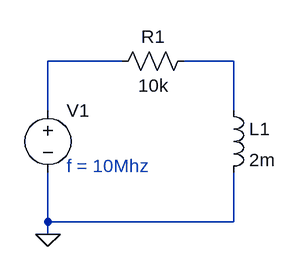
[diagram p0: schematic Draft2.asc]
Draft2.asc, the LTspice schematic file:
Version 4
SHEET 1 880 680
WIRE 192 64 96 64
WIRE 336 64 272 64
WIRE 96 128 96 64
WIRE 336 128 336 64
WIRE 96 272 96 208
WIRE 336 272 336 208
WIRE 336 272 96 272
WIRE 96 288 96 272
FLAG 96 288 0
SYMBOL voltage 96 112 R0
WINDOW 3 24 96 Invisible 2
WINDOW 123 0 0 Left 0
WINDOW 39 0 0 Left 0
SYMATTR InstName V1
SYMATTR Value SINE(0 3.3 10M)
SYMBOL res 288 48 R90
WINDOW 0 0 56 VBottom 2
WINDOW 3 32 56 VTop 2
SYMATTR InstName R1
SYMATTR Value 10k
SYMBOL ind 320 112 R0
SYMATTR InstName L1
SYMATTR Value 2m
TEXT 120 200 Left 2 ;f = 10Mhz

The netlist it stands for:
* Draft2.asc
V1 N001 0 SINE(0 3.3 10M)
R1 N002 N001 10k
L1 N002 0 2m
* f = 10Mhz
.backanno
.end